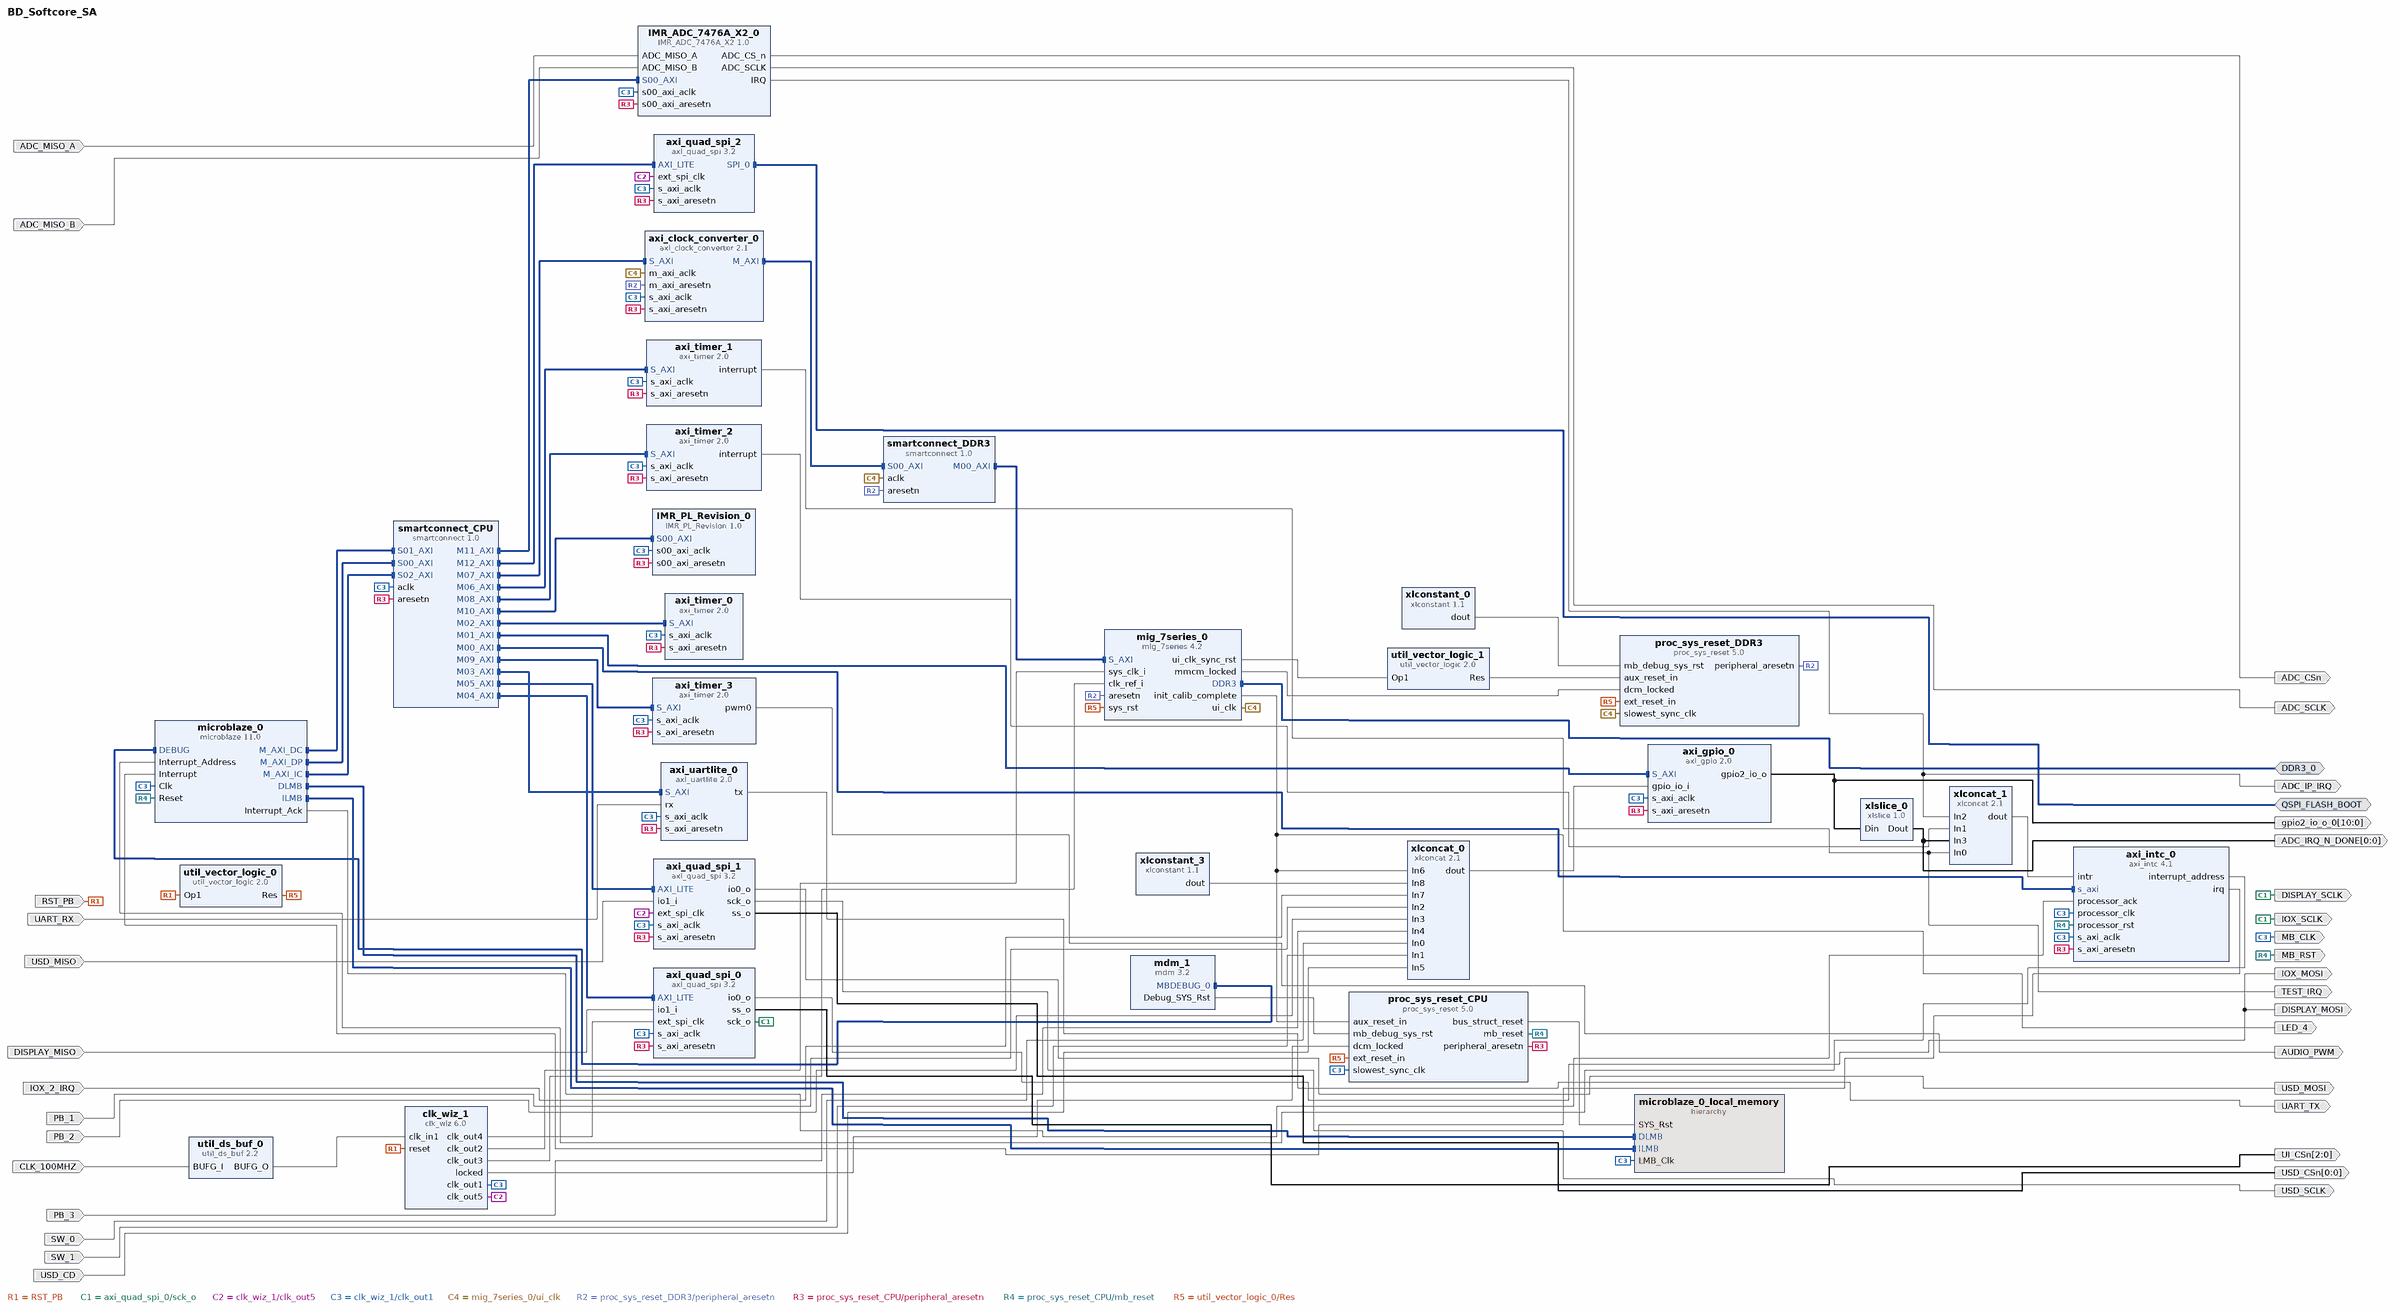
[diagram p0: block diagram of the top level]
# Vivado block design BD_Softcore_SA, xc7a100tcsg324-1, Vivado 2024.2
create_bd_design BD_Softcore_SA

create_bd_intf_port -mode Master -vlnv xilinx.com:interface:ddrx_rtl:1.0 DDR3_0
create_bd_intf_port -mode Master -vlnv xilinx.com:interface:spi_rtl:1.0 QSPI_FLASH_BOOT
create_bd_port -dir I CLK_100MHZ
create_bd_port -dir I RST_PB
create_bd_port -dir I PB_1
create_bd_port -dir I PB_2
create_bd_port -dir I PB_3
create_bd_port -dir I SW_0
create_bd_port -dir I SW_1
create_bd_port -dir I UART_RX
create_bd_port -dir O UART_TX
create_bd_port -dir O DISPLAY_MOSI
create_bd_port -dir O -from 2 -to 0 UI_CSn
create_bd_port -dir O DISPLAY_SCLK
create_bd_port -dir O -from 10 -to 0 gpio2_io_o_0
create_bd_port -dir I DISPLAY_MISO
create_bd_port -dir O -from 0 -to 0 ADC_IRQ_N_DONE
create_bd_port -dir O LED_4
create_bd_port -dir O -type rst MB_RST
create_bd_port -dir O -type clk MB_CLK
create_bd_port -dir O USD_MOSI
create_bd_port -dir I USD_MISO
create_bd_port -dir O -from 0 -to 0 USD_CSn
create_bd_port -dir O USD_SCLK
create_bd_port -dir I USD_CD
create_bd_port -dir O AUDIO_PWM
create_bd_port -dir O TEST_IRQ
create_bd_port -dir O IOX_MOSI
create_bd_port -dir O IOX_SCLK
create_bd_port -dir I IOX_2_IRQ
create_bd_port -dir I ADC_MISO_A
create_bd_port -dir I ADC_MISO_B
create_bd_port -dir O -type intr ADC_IP_IRQ
create_bd_port -dir O ADC_CSn
create_bd_port -dir O ADC_SCLK

create_bd_cell -type ip -vlnv xilinx.com:ip:microblaze:11.0 microblaze_0
set_property -dict [list \
  CONFIG.C_ADDR_TAG_BITS 12 \
  CONFIG.C_AREA_OPTIMIZED 0 \
  CONFIG.C_BASE_VECTORS 0x0000000000000000 \
  CONFIG.C_CACHE_BYTE_SIZE 65536 \
  CONFIG.C_DCACHE_ADDR_TAG 13 \
  CONFIG.C_DCACHE_BASEADDR 0x0000000080000000 \
  CONFIG.C_DCACHE_BYTE_SIZE 32768 \
  CONFIG.C_DCACHE_HIGHADDR 0x000000008FFFFFFF \
  CONFIG.C_DCACHE_USE_WRITEBACK 1 \
  CONFIG.C_DEBUG_ENABLED 1 \
  CONFIG.C_DIV_ZERO_EXCEPTION 1 \
  CONFIG.C_D_AXI 1 \
  CONFIG.C_D_LMB 1 \
  CONFIG.C_ENABLE_CONVERSION 0 \
  CONFIG.C_FPU_EXCEPTION 1 \
  CONFIG.C_ICACHE_BASEADDR 0x0000000080000000 \
  CONFIG.C_ICACHE_HIGHADDR 0x000000008FFFFFFF \
  CONFIG.C_ICACHE_LINE_LEN 8 \
  CONFIG.C_ICACHE_STREAMS 1 \
  CONFIG.C_ICACHE_VICTIMS 8 \
  CONFIG.C_ILL_OPCODE_EXCEPTION 1 \
  CONFIG.C_I_LMB 1 \
  CONFIG.C_MMU_ZONES 2 \
  CONFIG.C_M_AXI_D_BUS_EXCEPTION 1 \
  CONFIG.C_M_AXI_I_BUS_EXCEPTION 1 \
  CONFIG.C_NUMBER_OF_PC_BRK 2 \
  CONFIG.C_NUMBER_OF_RD_ADDR_BRK 1 \
  CONFIG.C_NUMBER_OF_WR_ADDR_BRK 1 \
  CONFIG.C_OPCODE_0x0_ILLEGAL 1 \
  CONFIG.C_PVR 2 \
  CONFIG.C_UNALIGNED_EXCEPTIONS 1 \
  CONFIG.C_USE_BARREL 1 \
  CONFIG.C_USE_DCACHE 1 \
  CONFIG.C_USE_DIV 1 \
  CONFIG.C_USE_FPU 2 \
  CONFIG.C_USE_HW_MUL 2 \
  CONFIG.C_USE_ICACHE 1 \
  CONFIG.C_USE_INTERRUPT 2 \
  CONFIG.C_USE_MMU 3 \
  CONFIG.C_USE_MSR_INSTR 1 \
  CONFIG.C_USE_PCMP_INSTR 1 \
  CONFIG.G_TEMPLATE_LIST 10 \
  CONFIG.G_USE_EXCEPTIONS 1 \
] [get_bd_cells microblaze_0]
create_bd_cell -type hier microblaze_0_local_memory
create_bd_cell -type ip -vlnv xilinx.com:ip:mdm:3.2 mdm_1
create_bd_cell -type ip -vlnv xilinx.com:ip:clk_wiz:6.0 clk_wiz_1
set_property -dict [list \
  CONFIG.CLKOUT2_JITTER 118.758 \
  CONFIG.CLKOUT2_PHASE_ERROR 98.575 \
  CONFIG.CLKOUT2_REQUESTED_OUT_FREQ 166.66667 \
  CONFIG.CLKOUT2_USED true \
  CONFIG.CLKOUT3_JITTER 114.829 \
  CONFIG.CLKOUT3_PHASE_ERROR 98.575 \
  CONFIG.CLKOUT3_REQUESTED_OUT_FREQ 200 \
  CONFIG.CLKOUT3_USED true \
  CONFIG.CLKOUT4_JITTER 183.243 \
  CONFIG.CLKOUT4_PHASE_ERROR 98.575 \
  CONFIG.CLKOUT4_REQUESTED_OUT_FREQ 20 \
  CONFIG.CLKOUT4_USED true \
  CONFIG.CLKOUT5_JITTER 151.636 \
  CONFIG.CLKOUT5_PHASE_ERROR 98.575 \
  CONFIG.CLKOUT5_REQUESTED_OUT_FREQ 50 \
  CONFIG.CLKOUT5_USED true \
  CONFIG.MMCM_CLKOUT1_DIVIDE 6 \
  CONFIG.MMCM_CLKOUT2_DIVIDE 5 \
  CONFIG.MMCM_CLKOUT3_DIVIDE 50 \
  CONFIG.MMCM_CLKOUT4_DIVIDE 20 \
  CONFIG.NUM_OUT_CLKS 5 \
  CONFIG.PRIM_SOURCE Single_ended_clock_capable_pin \
] [get_bd_cells clk_wiz_1]
create_bd_cell -type ip -vlnv xilinx.com:ip:proc_sys_reset:5.0 proc_sys_reset_CPU
create_bd_cell -type ip -vlnv xilinx.com:ip:util_ds_buf:2.2 util_ds_buf_0
set_property -dict {CONFIG.C_BUF_TYPE BUFG} [get_bd_cells util_ds_buf_0]
create_bd_cell -type ip -vlnv xilinx.com:ip:util_vector_logic:2.0 util_vector_logic_0
set_property -dict {CONFIG.C_OPERATION not CONFIG.C_SIZE 1} [get_bd_cells util_vector_logic_0]
create_bd_cell -type ip -vlnv xilinx.com:ip:smartconnect:1.0 smartconnect_CPU
set_property -dict {CONFIG.NUM_MI 13 CONFIG.NUM_SI 3} [get_bd_cells smartconnect_CPU]
create_bd_cell -type ip -vlnv xilinx.com:ip:axi_clock_converter:2.1 axi_clock_converter_0
create_bd_cell -type ip -vlnv xilinx.com:ip:axi_gpio:2.0 axi_gpio_0
set_property -dict [list \
  CONFIG.C_ALL_INPUTS 1 \
  CONFIG.C_ALL_OUTPUTS_2 1 \
  CONFIG.C_GPIO2_WIDTH 11 \
  CONFIG.C_GPIO_WIDTH 12 \
  CONFIG.C_IS_DUAL 1 \
] [get_bd_cells axi_gpio_0]
create_bd_cell -type ip -vlnv xilinx.com:ip:xlconcat:2.1 xlconcat_0
set_property -dict {CONFIG.IN8_WIDTH 4 CONFIG.NUM_PORTS 9} [get_bd_cells xlconcat_0]
create_bd_cell -type ip -vlnv xilinx.com:ip:axi_uartlite:2.0 axi_uartlite_0
set_property -dict {CONFIG.C_BAUDRATE 115200} [get_bd_cells axi_uartlite_0]
create_bd_cell -type ip -vlnv xilinx.com:ip:axi_intc:4.1 axi_intc_0
set_property -dict [list \
  CONFIG.C_HAS_FAST 1 \
  CONFIG.C_HAS_ILR 0 \
  CONFIG.C_IRQ_IS_LEVEL 1 \
  CONFIG.C_KIND_OF_INTR 0xFFFFFFFF \
] [get_bd_cells axi_intc_0]
create_bd_cell -type ip -vlnv xilinx.com:ip:xlconcat:2.1 xlconcat_1
set_property -dict {CONFIG.NUM_PORTS 4} [get_bd_cells xlconcat_1]
create_bd_cell -type ip -vlnv xilinx.com:ip:xlconstant:1.1 xlconstant_3
set_property -dict {CONFIG.CONST_VAL 6 CONFIG.CONST_WIDTH 4} [get_bd_cells xlconstant_3]
create_bd_cell -type ip -vlnv xilinx.com:ip:xlslice:1.0 xlslice_0
set_property -dict {CONFIG.DIN_FROM 5 CONFIG.DIN_TO 5 CONFIG.DIN_WIDTH 11} [get_bd_cells xlslice_0]
create_bd_cell -type ip -vlnv xilinx.com:ip:axi_quad_spi:3.2 axi_quad_spi_0
set_property -dict {CONFIG.C_NUM_SS_BITS 3 CONFIG.C_SCK_RATIO 2 CONFIG.C_USE_STARTUP 0} [get_bd_cells axi_quad_spi_0]
create_bd_cell -type ip -vlnv xilinx.com:ip:smartconnect:1.0 smartconnect_DDR3
set_property -dict {CONFIG.NUM_MI 1 CONFIG.NUM_SI 1} [get_bd_cells smartconnect_DDR3]
create_bd_cell -type ip -vlnv xilinx.com:ip:proc_sys_reset:5.0 proc_sys_reset_DDR3
create_bd_cell -type ip -vlnv xilinx.com:ip:xlconstant:1.1 xlconstant_0
set_property -dict {CONFIG.CONST_VAL 0} [get_bd_cells xlconstant_0]
create_bd_cell -type ip -vlnv xilinx.com:ip:util_vector_logic:2.0 util_vector_logic_1
set_property -dict {CONFIG.C_OPERATION not CONFIG.C_SIZE 1} [get_bd_cells util_vector_logic_1]
create_bd_cell -type ip -vlnv xilinx.com:ip:mig_7series:4.2 mig_7series_0
set_property -dict [list \
  CONFIG.BOARD_MIG_PARAM Custom \
  CONFIG.MIG_DONT_TOUCH_PARAM Custom \
  CONFIG.RESET_BOARD_INTERFACE Custom \
  CONFIG.XML_INPUT_FILE mig_a.prj \
] [get_bd_cells mig_7series_0]
create_bd_cell -type ip -vlnv xilinx.com:ip:axi_quad_spi:3.2 axi_quad_spi_1
set_property -dict {CONFIG.C_SCK_RATIO 2 CONFIG.C_USE_STARTUP 0} [get_bd_cells axi_quad_spi_1]
create_bd_cell -type ip -vlnv xilinx.com:ip:axi_timer:2.0 axi_timer_1
set_property -dict {CONFIG.enable_timer2 0} [get_bd_cells axi_timer_1]
create_bd_cell -type ip -vlnv xilinx.com:ip:axi_timer:2.0 axi_timer_0
set_property -dict {CONFIG.enable_timer2 0} [get_bd_cells axi_timer_0]
create_bd_cell -type ip -vlnv xilinx.com:ip:axi_timer:2.0 axi_timer_2
create_bd_cell -type ip -vlnv xilinx.com:ip:axi_timer:2.0 axi_timer_3
create_bd_cell -type ip -vlnv IMR:user:IMR_PL_Revision:1.0 IMR_PL_Revision_0
set_property -dict {CONFIG.C_REVISION_TEST 8} [get_bd_cells IMR_PL_Revision_0]
create_bd_cell -type ip -vlnv IMR:user:IMR_ADC_7476A_X2:1.0 IMR_ADC_7476A_X2_0
create_bd_cell -type ip -vlnv xilinx.com:ip:axi_quad_spi:3.2 axi_quad_spi_2
set_property -dict {CONFIG.C_SPI_MEMORY 3 CONFIG.C_SPI_MODE 2} [get_bd_cells axi_quad_spi_2]

# ---- hierarchy /microblaze_0_local_memory ----
current_bd_instance /microblaze_0_local_memory
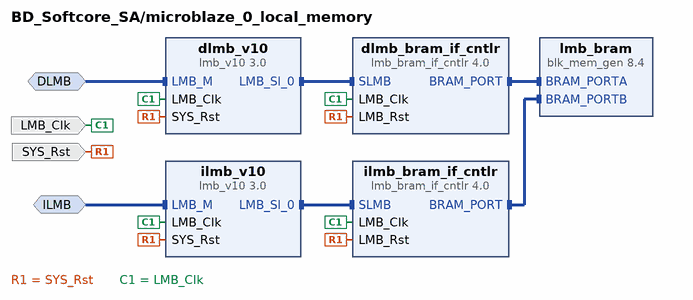
[diagram p1: block diagram inside /microblaze_0_local_memory]
create_bd_intf_pin -mode MirroredMaster -vlnv xilinx.com:interface:lmb_rtl:1.0 DLMB
create_bd_intf_pin -mode MirroredMaster -vlnv xilinx.com:interface:lmb_rtl:1.0 ILMB
create_bd_pin -dir I -type clk LMB_Clk
create_bd_pin -dir I -type rst SYS_Rst

create_bd_cell -type ip -vlnv xilinx.com:ip:lmb_v10:3.0 dlmb_v10
create_bd_cell -type ip -vlnv xilinx.com:ip:lmb_v10:3.0 ilmb_v10
create_bd_cell -type ip -vlnv xilinx.com:ip:lmb_bram_if_cntlr:4.0 dlmb_bram_if_cntlr
set_property -dict {CONFIG.C_ECC 0} [get_bd_cells dlmb_bram_if_cntlr]
create_bd_cell -type ip -vlnv xilinx.com:ip:lmb_bram_if_cntlr:4.0 ilmb_bram_if_cntlr
set_property -dict {CONFIG.C_ECC 0} [get_bd_cells ilmb_bram_if_cntlr]
create_bd_cell -type ip -vlnv xilinx.com:ip:blk_mem_gen:8.4 lmb_bram
set_property -dict {CONFIG.Memory_Type True_Dual_Port_RAM CONFIG.use_bram_block BRAM_Controller} [get_bd_cells lmb_bram]

# ---- connections ----

current_bd_instance /microblaze_0_local_memory
connect_bd_intf_net -intf_net microblaze_0_dlmb [get_bd_intf_pins dlmb_v10/LMB_M] [get_bd_intf_pins DLMB]
connect_bd_intf_net -intf_net microblaze_0_dlmb_bus [get_bd_intf_pins dlmb_v10/LMB_Sl_0] [get_bd_intf_pins dlmb_bram_if_cntlr/SLMB]
connect_bd_intf_net -intf_net microblaze_0_dlmb_cntlr [get_bd_intf_pins dlmb_bram_if_cntlr/BRAM_PORT] [get_bd_intf_pins lmb_bram/BRAM_PORTA]
connect_bd_intf_net -intf_net microblaze_0_ilmb [get_bd_intf_pins ilmb_v10/LMB_M] [get_bd_intf_pins ILMB]
connect_bd_intf_net -intf_net microblaze_0_ilmb_bus [get_bd_intf_pins ilmb_v10/LMB_Sl_0] [get_bd_intf_pins ilmb_bram_if_cntlr/SLMB]
connect_bd_intf_net -intf_net microblaze_0_ilmb_cntlr [get_bd_intf_pins ilmb_bram_if_cntlr/BRAM_PORT] [get_bd_intf_pins lmb_bram/BRAM_PORTB]
connect_bd_net [get_bd_pins SYS_Rst] \
  [get_bd_pins dlmb_v10/SYS_Rst] [get_bd_pins dlmb_bram_if_cntlr/LMB_Rst] [get_bd_pins ilmb_v10/SYS_Rst] \
  [get_bd_pins ilmb_bram_if_cntlr/LMB_Rst]
connect_bd_net -net microblaze_0_Clk [get_bd_pins LMB_Clk] \
  [get_bd_pins dlmb_v10/LMB_Clk] [get_bd_pins dlmb_bram_if_cntlr/LMB_Clk] [get_bd_pins ilmb_v10/LMB_Clk] \
  [get_bd_pins ilmb_bram_if_cntlr/LMB_Clk]
set_property HDL_ATTRIBUTE.BMM_INFO_ADDRESS_SPACE {byte  0x00000000 32 > BD_Softcore_SA microblaze_0_local_memory/lmb_bram} [get_bd_cells dlmb_bram_if_cntlr]
set_property HDL_ATTRIBUTE.KEEP_HIERARCHY yes [get_bd_cells dlmb_bram_if_cntlr]

current_bd_instance /
connect_bd_intf_net [get_bd_intf_pins axi_clock_converter_0/M_AXI] [get_bd_intf_pins smartconnect_DDR3/S00_AXI]
connect_bd_intf_net [get_bd_intf_ports QSPI_FLASH_BOOT] [get_bd_intf_pins axi_quad_spi_2/SPI_0]
connect_bd_intf_net [get_bd_intf_pins microblaze_0/M_AXI_DC] [get_bd_intf_pins smartconnect_CPU/S01_AXI]
connect_bd_intf_net [get_bd_intf_pins microblaze_0/M_AXI_DP] [get_bd_intf_pins smartconnect_CPU/S00_AXI]
connect_bd_intf_net [get_bd_intf_pins microblaze_0/M_AXI_IC] [get_bd_intf_pins smartconnect_CPU/S02_AXI]
connect_bd_intf_net [get_bd_intf_pins mdm_1/MBDEBUG_0] [get_bd_intf_pins microblaze_0/DEBUG]
connect_bd_intf_net [get_bd_intf_pins microblaze_0/DLMB] [get_bd_intf_pins microblaze_0_local_memory/DLMB]
connect_bd_intf_net [get_bd_intf_pins microblaze_0/ILMB] [get_bd_intf_pins microblaze_0_local_memory/ILMB]
connect_bd_intf_net [get_bd_intf_ports DDR3_0] [get_bd_intf_pins mig_7series_0/DDR3]
connect_bd_intf_net -intf_net smartconnect_0_M00_AXI [get_bd_intf_pins smartconnect_DDR3/M00_AXI] [get_bd_intf_pins mig_7series_0/S_AXI]
connect_bd_intf_net [get_bd_intf_pins smartconnect_CPU/M00_AXI] [get_bd_intf_pins axi_intc_0/s_axi]
connect_bd_intf_net [get_bd_intf_pins smartconnect_CPU/M01_AXI] [get_bd_intf_pins axi_gpio_0/S_AXI]
connect_bd_intf_net [get_bd_intf_pins smartconnect_CPU/M02_AXI] [get_bd_intf_pins axi_timer_0/S_AXI]
connect_bd_intf_net [get_bd_intf_pins smartconnect_CPU/M03_AXI] [get_bd_intf_pins axi_uartlite_0/S_AXI]
connect_bd_intf_net [get_bd_intf_pins smartconnect_CPU/M04_AXI] [get_bd_intf_pins axi_quad_spi_0/AXI_LITE]
connect_bd_intf_net [get_bd_intf_pins smartconnect_CPU/M05_AXI] [get_bd_intf_pins axi_quad_spi_1/AXI_LITE]
connect_bd_intf_net [get_bd_intf_pins smartconnect_CPU/M06_AXI] [get_bd_intf_pins axi_timer_1/S_AXI]
connect_bd_intf_net [get_bd_intf_pins smartconnect_CPU/M07_AXI] [get_bd_intf_pins axi_clock_converter_0/S_AXI]
connect_bd_intf_net [get_bd_intf_pins smartconnect_CPU/M08_AXI] [get_bd_intf_pins axi_timer_2/S_AXI]
connect_bd_intf_net [get_bd_intf_pins smartconnect_CPU/M09_AXI] [get_bd_intf_pins axi_timer_3/S_AXI]
connect_bd_intf_net [get_bd_intf_pins smartconnect_CPU/M10_AXI] [get_bd_intf_pins IMR_PL_Revision_0/S00_AXI]
connect_bd_intf_net [get_bd_intf_pins smartconnect_CPU/M11_AXI] [get_bd_intf_pins IMR_ADC_7476A_X2_0/S00_AXI]
connect_bd_intf_net [get_bd_intf_pins smartconnect_CPU/M12_AXI] [get_bd_intf_pins axi_quad_spi_2/AXI_LITE]
connect_bd_net -net ADC_MISO_A_0_1 [get_bd_ports ADC_MISO_A] [get_bd_pins IMR_ADC_7476A_X2_0/ADC_MISO_A]
connect_bd_net -net ADC_MISO_B_0_1 [get_bd_ports ADC_MISO_B] [get_bd_pins IMR_ADC_7476A_X2_0/ADC_MISO_B]
connect_bd_net [get_bd_ports CLK_100MHZ] [get_bd_pins util_ds_buf_0/BUFG_I]
connect_bd_net [get_bd_ports DISPLAY_MISO] [get_bd_pins axi_quad_spi_0/io1_i]
connect_bd_net [get_bd_pins IMR_ADC_7476A_X2_0/ADC_CS_n] [get_bd_ports ADC_CSn]
connect_bd_net [get_bd_pins IMR_ADC_7476A_X2_0/ADC_SCLK] [get_bd_ports ADC_SCLK]
connect_bd_net [get_bd_pins IMR_ADC_7476A_X2_0/IRQ] [get_bd_pins xlconcat_1/In2] [get_bd_ports ADC_IP_IRQ]
connect_bd_net [get_bd_ports IOX_2_IRQ] [get_bd_pins xlconcat_0/In7]
connect_bd_net -net PB_1_1 [get_bd_ports PB_1] [get_bd_pins xlconcat_0/In2]
connect_bd_net -net PB_2_1 [get_bd_ports PB_2] [get_bd_pins xlconcat_0/In3]
connect_bd_net -net PB_3_1 [get_bd_ports PB_3] [get_bd_pins xlconcat_0/In4]
connect_bd_net [get_bd_ports RST_PB] [get_bd_pins util_vector_logic_0/Op1] [get_bd_pins clk_wiz_1/reset]
connect_bd_net -net SW_0_1 [get_bd_ports SW_0] [get_bd_pins xlconcat_0/In0]
connect_bd_net -net SW_1_1 [get_bd_ports SW_1] [get_bd_pins xlconcat_0/In1]
connect_bd_net [get_bd_ports USD_CD] [get_bd_pins xlconcat_0/In5]
connect_bd_net [get_bd_pins axi_gpio_0/gpio2_io_o] [get_bd_ports gpio2_io_o_0] [get_bd_pins xlslice_0/Din]
connect_bd_net [get_bd_pins axi_intc_0/interrupt_address] [get_bd_pins microblaze_0/Interrupt_Address]
connect_bd_net [get_bd_pins axi_intc_0/irq] [get_bd_pins microblaze_0/Interrupt]
connect_bd_net [get_bd_pins axi_quad_spi_0/io0_o] [get_bd_ports DISPLAY_MOSI] [get_bd_ports IOX_MOSI]
connect_bd_net [get_bd_pins axi_quad_spi_0/sck_o] [get_bd_ports DISPLAY_SCLK] [get_bd_ports IOX_SCLK]
connect_bd_net [get_bd_pins axi_quad_spi_0/ss_o] [get_bd_ports UI_CSn]
connect_bd_net [get_bd_pins axi_quad_spi_1/io0_o] [get_bd_ports USD_MOSI]
connect_bd_net [get_bd_pins axi_quad_spi_1/sck_o] [get_bd_ports USD_SCLK]
connect_bd_net [get_bd_pins axi_quad_spi_1/ss_o] [get_bd_ports USD_CSn]
connect_bd_net [get_bd_pins axi_timer_1/interrupt] [get_bd_pins xlconcat_1/In0] [get_bd_ports TEST_IRQ]
connect_bd_net [get_bd_pins axi_timer_2/interrupt] [get_bd_pins xlconcat_1/In1]
connect_bd_net [get_bd_pins axi_timer_3/pwm0] [get_bd_ports AUDIO_PWM]
connect_bd_net [get_bd_pins axi_uartlite_0/tx] [get_bd_ports UART_TX]
connect_bd_net [get_bd_pins clk_wiz_1/clk_out2] [get_bd_pins mig_7series_0/sys_clk_i]
connect_bd_net [get_bd_pins clk_wiz_1/clk_out3] [get_bd_pins mig_7series_0/clk_ref_i]
connect_bd_net [get_bd_pins clk_wiz_1/clk_out4] [get_bd_pins axi_quad_spi_0/ext_spi_clk]
connect_bd_net [get_bd_pins clk_wiz_1/clk_out5] [get_bd_pins axi_quad_spi_1/ext_spi_clk] [get_bd_pins axi_quad_spi_2/ext_spi_clk]
connect_bd_net [get_bd_pins clk_wiz_1/locked] [get_bd_pins proc_sys_reset_CPU/dcm_locked]
connect_bd_net -net io1_i_0_1 [get_bd_ports USD_MISO] [get_bd_pins axi_quad_spi_1/io1_i]
connect_bd_net [get_bd_pins mdm_1/Debug_SYS_Rst] [get_bd_pins proc_sys_reset_CPU/mb_debug_sys_rst]
connect_bd_net -net microblaze_0_Clk [get_bd_pins clk_wiz_1/clk_out1] \
  [get_bd_pins microblaze_0_local_memory/LMB_Clk] [get_bd_pins proc_sys_reset_CPU/slowest_sync_clk] \
  [get_bd_pins axi_clock_converter_0/s_axi_aclk] [get_bd_pins axi_gpio_0/s_axi_aclk] [get_bd_pins axi_uartlite_0/s_axi_aclk] \
  [get_bd_pins axi_quad_spi_0/s_axi_aclk] [get_bd_ports MB_CLK] [get_bd_pins axi_quad_spi_1/s_axi_aclk] \
  [get_bd_pins axi_timer_1/s_axi_aclk] [get_bd_pins axi_timer_0/s_axi_aclk] [get_bd_pins axi_intc_0/s_axi_aclk] \
  [get_bd_pins axi_timer_2/s_axi_aclk] [get_bd_pins axi_intc_0/processor_clk] [get_bd_pins axi_timer_3/s_axi_aclk] \
  [get_bd_pins microblaze_0/Clk] [get_bd_pins smartconnect_CPU/aclk] [get_bd_pins IMR_PL_Revision_0/s00_axi_aclk] \
  [get_bd_pins IMR_ADC_7476A_X2_0/s00_axi_aclk] [get_bd_pins axi_quad_spi_2/s_axi_aclk]
connect_bd_net [get_bd_pins microblaze_0/Interrupt_Ack] [get_bd_pins axi_intc_0/processor_ack]
connect_bd_net [get_bd_pins mig_7series_0/init_calib_complete] \
  [get_bd_ports LED_4] [get_bd_pins proc_sys_reset_CPU/aux_reset_in] [get_bd_pins xlconcat_0/In6]
connect_bd_net [get_bd_pins mig_7series_0/mmcm_locked] [get_bd_pins proc_sys_reset_DDR3/dcm_locked]
connect_bd_net [get_bd_pins mig_7series_0/ui_clk] \
  [get_bd_pins axi_clock_converter_0/m_axi_aclk] [get_bd_pins proc_sys_reset_DDR3/slowest_sync_clk] \
  [get_bd_pins smartconnect_DDR3/aclk]
connect_bd_net [get_bd_pins mig_7series_0/ui_clk_sync_rst] [get_bd_pins util_vector_logic_1/Op1]
connect_bd_net -net proc_sys_reset_0_peripheral_aresetn [get_bd_pins proc_sys_reset_DDR3/peripheral_aresetn] \
  [get_bd_pins axi_clock_converter_0/m_axi_aresetn] [get_bd_pins mig_7series_0/aresetn] \
  [get_bd_pins smartconnect_DDR3/aresetn]
connect_bd_net [get_bd_pins proc_sys_reset_CPU/peripheral_aresetn] \
  [get_bd_pins axi_clock_converter_0/s_axi_aresetn] [get_bd_pins axi_gpio_0/s_axi_aresetn] \
  [get_bd_pins axi_uartlite_0/s_axi_aresetn] [get_bd_pins axi_quad_spi_0/s_axi_aresetn] \
  [get_bd_pins axi_quad_spi_1/s_axi_aresetn] [get_bd_pins axi_timer_1/s_axi_aresetn] [get_bd_pins axi_timer_0/s_axi_aresetn] \
  [get_bd_pins axi_intc_0/s_axi_aresetn] [get_bd_pins axi_timer_2/s_axi_aresetn] [get_bd_pins axi_timer_3/s_axi_aresetn] \
  [get_bd_pins smartconnect_CPU/aresetn] [get_bd_pins IMR_PL_Revision_0/s00_axi_aresetn] \
  [get_bd_pins IMR_ADC_7476A_X2_0/s00_axi_aresetn] [get_bd_pins axi_quad_spi_2/s_axi_aresetn]
connect_bd_net -net rst_clk_wiz_1_100M_bus_struct_reset [get_bd_pins proc_sys_reset_CPU/bus_struct_reset] \
  [get_bd_pins microblaze_0_local_memory/SYS_Rst]
connect_bd_net -net rst_clk_wiz_1_100M_mb_reset [get_bd_pins proc_sys_reset_CPU/mb_reset] \
  [get_bd_ports MB_RST] [get_bd_pins axi_intc_0/processor_rst] [get_bd_pins microblaze_0/Reset]
connect_bd_net -net rx_0_1 [get_bd_ports UART_RX] [get_bd_pins axi_uartlite_0/rx]
connect_bd_net [get_bd_pins util_ds_buf_0/BUFG_O] [get_bd_pins clk_wiz_1/clk_in1]
connect_bd_net [get_bd_pins util_vector_logic_0/Res] \
  [get_bd_pins proc_sys_reset_CPU/ext_reset_in] [get_bd_pins proc_sys_reset_DDR3/ext_reset_in] \
  [get_bd_pins mig_7series_0/sys_rst]
connect_bd_net [get_bd_pins util_vector_logic_1/Res] [get_bd_pins proc_sys_reset_DDR3/aux_reset_in]
connect_bd_net [get_bd_pins xlconcat_0/dout] [get_bd_pins axi_gpio_0/gpio_io_i]
connect_bd_net [get_bd_pins xlconcat_1/dout] [get_bd_pins axi_intc_0/intr]
connect_bd_net [get_bd_pins xlconstant_0/dout] [get_bd_pins proc_sys_reset_DDR3/mb_debug_sys_rst]
connect_bd_net [get_bd_pins xlconstant_3/dout] [get_bd_pins xlconcat_0/In8]
connect_bd_net [get_bd_pins xlslice_0/Dout] [get_bd_pins xlconcat_1/In3] [get_bd_ports ADC_IRQ_N_DONE]
set_property HDL_ATTRIBUTE.BMM_INFO_PROCESSOR {microblaze-le > BD_Softcore_SA microblaze_0_local_memory/dlmb_bram_if_cntlr} [get_bd_cells microblaze_0]
set_property HDL_ATTRIBUTE.KEEP_HIERARCHY yes [get_bd_cells microblaze_0]

# ---- address map ----
assign_bd_address -offset 0x00000000 -range 128K -target_address_space [get_bd_addr_spaces microblaze_0/Data] [get_bd_addr_segs microblaze_0_local_memory/dlmb_bram_if_cntlr/SLMB/Mem]
assign_bd_address -offset 0x40000000 -range 64K -target_address_space [get_bd_addr_spaces microblaze_0/Data] [get_bd_addr_segs axi_gpio_0/S_AXI/Reg]
assign_bd_address -offset 0x40600000 -range 64K -target_address_space [get_bd_addr_spaces microblaze_0/Data] [get_bd_addr_segs axi_uartlite_0/S_AXI/Reg]
assign_bd_address -offset 0x41200000 -range 64K -target_address_space [get_bd_addr_spaces microblaze_0/Data] [get_bd_addr_segs axi_intc_0/S_AXI/Reg]
assign_bd_address -offset 0x41C00000 -range 64K -target_address_space [get_bd_addr_spaces microblaze_0/Data] [get_bd_addr_segs axi_timer_0/S_AXI/Reg]
assign_bd_address -offset 0x41C10000 -range 64K -target_address_space [get_bd_addr_spaces microblaze_0/Data] [get_bd_addr_segs axi_timer_1/S_AXI/Reg]
assign_bd_address -offset 0x41C20000 -range 64K -target_address_space [get_bd_addr_spaces microblaze_0/Data] [get_bd_addr_segs axi_timer_2/S_AXI/Reg]
assign_bd_address -offset 0x41C30000 -range 64K -target_address_space [get_bd_addr_spaces microblaze_0/Data] [get_bd_addr_segs axi_timer_3/S_AXI/Reg]
assign_bd_address -offset 0x44A00000 -range 64K -target_address_space [get_bd_addr_spaces microblaze_0/Data] [get_bd_addr_segs axi_quad_spi_1/AXI_LITE/Reg]
assign_bd_address -offset 0x44A10000 -range 64K -target_address_space [get_bd_addr_spaces microblaze_0/Data] [get_bd_addr_segs axi_quad_spi_0/AXI_LITE/Reg]
assign_bd_address -offset 0x44A20000 -range 64K -target_address_space [get_bd_addr_spaces microblaze_0/Data] [get_bd_addr_segs IMR_PL_Revision_0/S00_AXI/S00_AXI_reg]
assign_bd_address -offset 0x44A30000 -range 64K -target_address_space [get_bd_addr_spaces microblaze_0/Data] [get_bd_addr_segs IMR_ADC_7476A_X2_0/S00_AXI/S00_AXI_reg]
assign_bd_address -offset 0x44A40000 -range 64K -target_address_space [get_bd_addr_spaces microblaze_0/Data] [get_bd_addr_segs axi_quad_spi_2/AXI_LITE/Reg]
assign_bd_address -offset 0x80000000 -range 256M -target_address_space [get_bd_addr_spaces microblaze_0/Data] [get_bd_addr_segs mig_7series_0/memmap/memaddr]
assign_bd_address -offset 0x00000000 -range 128K -target_address_space [get_bd_addr_spaces microblaze_0/Instruction] [get_bd_addr_segs microblaze_0_local_memory/ilmb_bram_if_cntlr/SLMB/Mem]
assign_bd_address -offset 0x40000000 -range 64K -target_address_space [get_bd_addr_spaces microblaze_0/Instruction] [get_bd_addr_segs axi_gpio_0/S_AXI/Reg]
assign_bd_address -offset 0x40600000 -range 64K -target_address_space [get_bd_addr_spaces microblaze_0/Instruction] [get_bd_addr_segs axi_uartlite_0/S_AXI/Reg]
assign_bd_address -offset 0x41200000 -range 64K -target_address_space [get_bd_addr_spaces microblaze_0/Instruction] [get_bd_addr_segs axi_intc_0/S_AXI/Reg]
assign_bd_address -offset 0x41C00000 -range 64K -target_address_space [get_bd_addr_spaces microblaze_0/Instruction] [get_bd_addr_segs axi_timer_0/S_AXI/Reg]
assign_bd_address -offset 0x41C10000 -range 64K -target_address_space [get_bd_addr_spaces microblaze_0/Instruction] [get_bd_addr_segs axi_timer_1/S_AXI/Reg]
assign_bd_address -offset 0x41C20000 -range 64K -target_address_space [get_bd_addr_spaces microblaze_0/Instruction] [get_bd_addr_segs axi_timer_2/S_AXI/Reg]
assign_bd_address -offset 0x41C30000 -range 64K -target_address_space [get_bd_addr_spaces microblaze_0/Instruction] [get_bd_addr_segs axi_timer_3/S_AXI/Reg]
assign_bd_address -offset 0x44A00000 -range 64K -target_address_space [get_bd_addr_spaces microblaze_0/Instruction] [get_bd_addr_segs axi_quad_spi_1/AXI_LITE/Reg]
assign_bd_address -offset 0x44A10000 -range 64K -target_address_space [get_bd_addr_spaces microblaze_0/Instruction] [get_bd_addr_segs axi_quad_spi_0/AXI_LITE/Reg]
assign_bd_address -offset 0x44A20000 -range 64K -target_address_space [get_bd_addr_spaces microblaze_0/Instruction] [get_bd_addr_segs IMR_PL_Revision_0/S00_AXI/S00_AXI_reg]
assign_bd_address -offset 0x44A30000 -range 64K -target_address_space [get_bd_addr_spaces microblaze_0/Instruction] [get_bd_addr_segs IMR_ADC_7476A_X2_0/S00_AXI/S00_AXI_reg]
assign_bd_address -offset 0x44A40000 -range 64K -target_address_space [get_bd_addr_spaces microblaze_0/Instruction] [get_bd_addr_segs axi_quad_spi_2/AXI_LITE/Reg]
assign_bd_address -offset 0x80000000 -range 256M -target_address_space [get_bd_addr_spaces microblaze_0/Instruction] [get_bd_addr_segs mig_7series_0/memmap/memaddr]

set_property USER_COMMENTS.comment_0 {This interface used ONLY 
by bootloader} [current_bd_design]
set_property USER_COMMENTS.comment_1 {Custom IP
PL Revision RTL} [current_bd_design]
set_property USER_COMMENTS.comment_2 {Custom IP
PL Dual ADC 7476A} [current_bd_design]

validate_bd_design
save_bd_design
